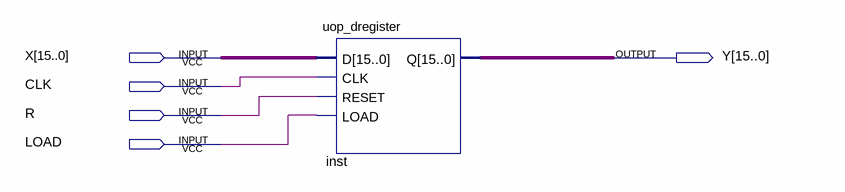
[diagram p0: schematic sheet]
// Quartus schematic behavioural.bdf as structural Verilog: 1 symbols, 5 pins
module behavioural (
  input  [15:0] X,
  input  CLK,
  input  R,
  input  LOAD,
  output [15:0] Y
);

  uop_dregister inst (.D(X), .CLK(CLK), .RESET(R), .LOAD(LOAD), .Q(Y));
endmodule
